# EAGLE design rgb_led (EAGLE 6.4)
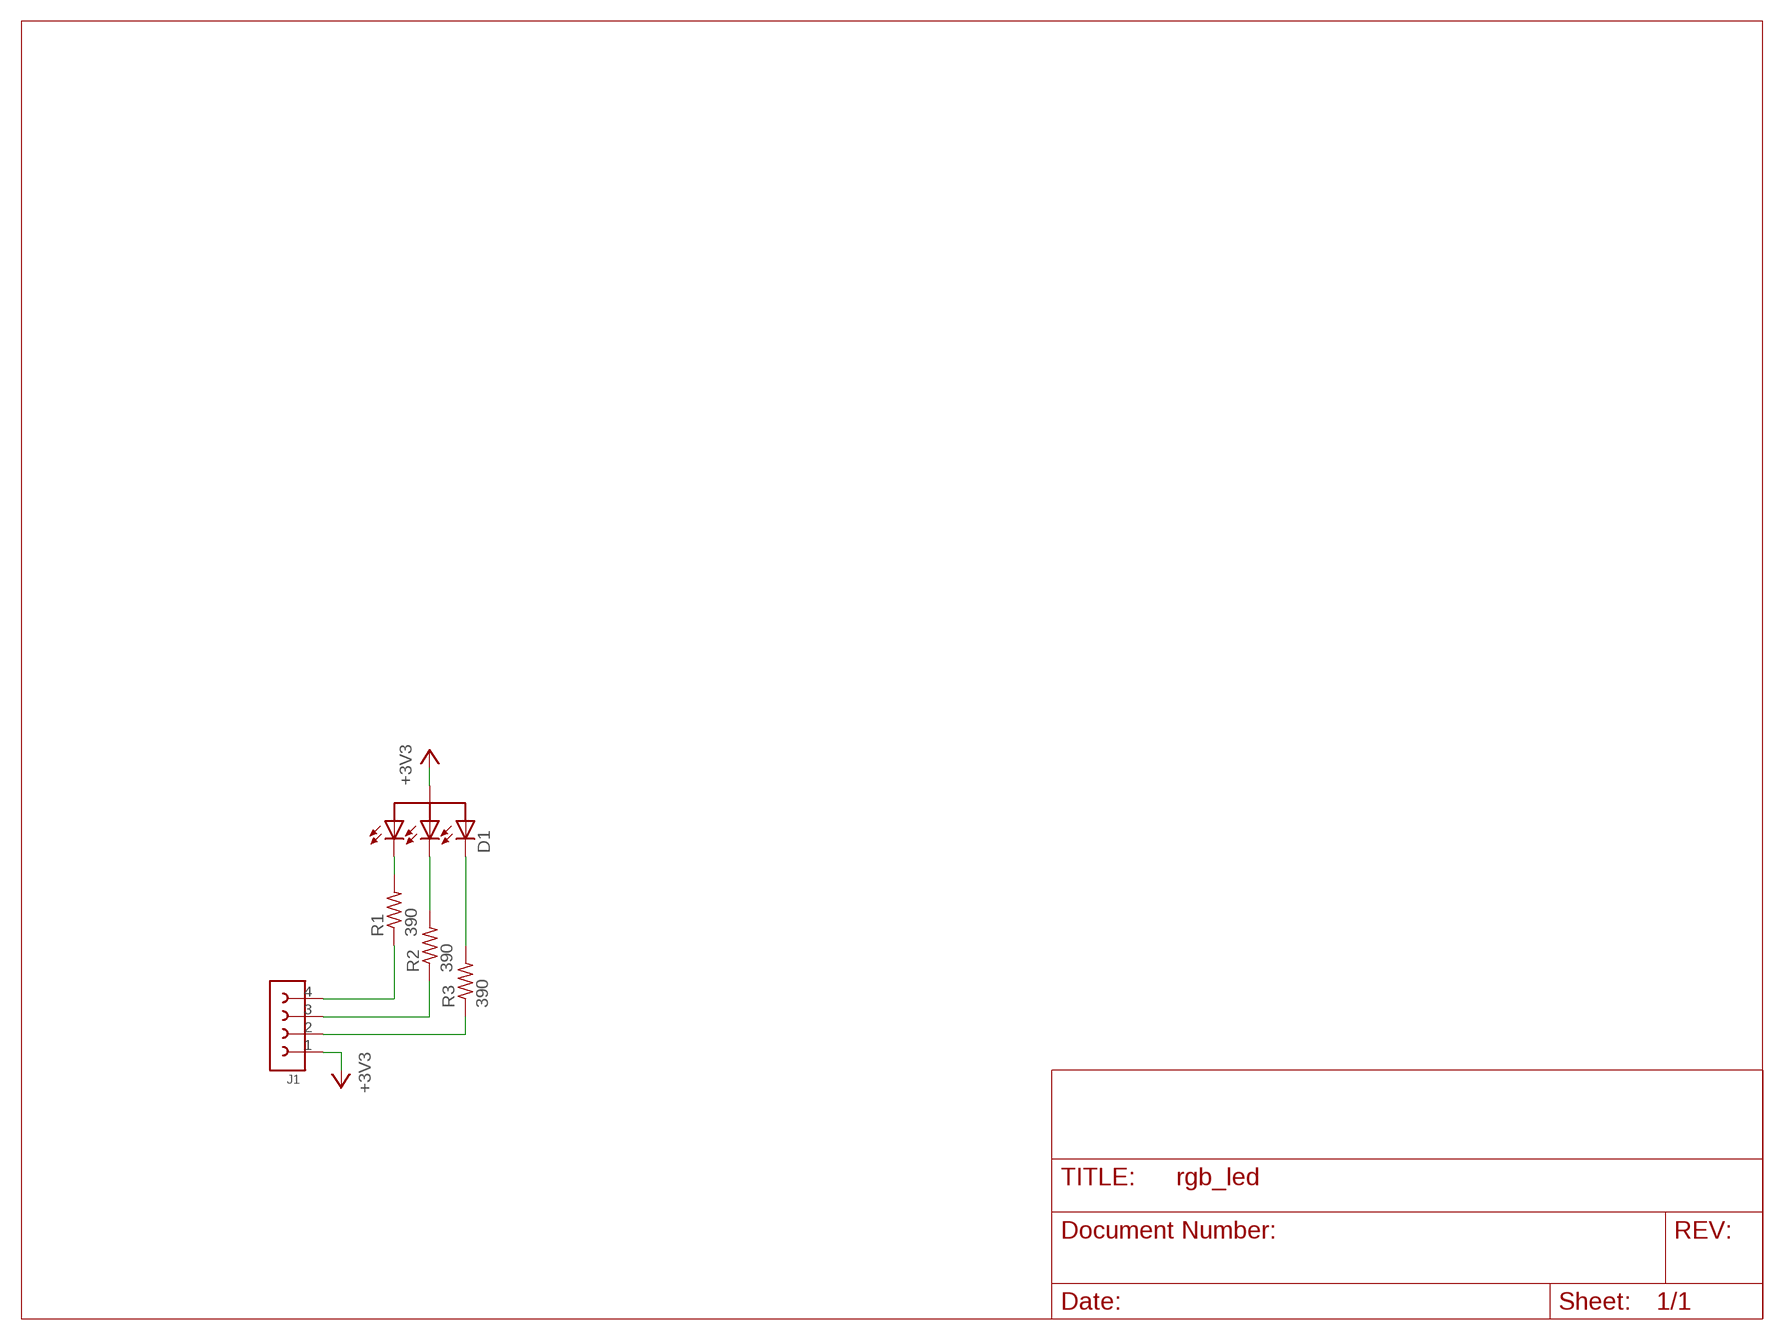
[diagram p0: schematic, sheet 1]

## Parts
D1  SM1210RGB  [D1210]
J1  61300411121  [PHSP254P1016X254X1154-4S]
R1  390  CRG0603F390R  [RESC0603]
R2  390  CRG0603F390R  [RESC0603]
R3  390  CRG0603F390R  [RESC0603]

## Nets
+3V3: D1.1(A) J1.1
N$1: D1.2(C3) R1.P$2
N$2: D1.4(C2) R2.P$2
N$3: D1.3(C1) R3.P$2
N$4: J1.4 R1.P$1
N$5: J1.2 R3.P$1
N$6: J1.3 R2.P$1

## Library data of the parts
D1 = bivar-smleds:SM1210RGB: Surface Mount RGB LED 1210 Description Bivar Surface Mount 1210 package RGB LED combines three chips in a single package. They are ideal for small scale applications where multiple signals need to be displayed. Wide variety of colors can be created by simply mixing the three chips in different combinations. Bivar offers water clear LED lens for high luminous intensity and wide viewing angles making them suitable for lighting and display applications. The SM1210 RGB LED is packaged in standard tape and reels for pick and place assemblies. ♦ Industry Standard Package ♦ RoHS Compliant ♦ Three Chips in One Package ♦ Water Clear Lens ♦ Wide Viewing Angle ♦ Ideal for Status Indication and Lighting How to Order Ref: Link <http://www.bivar.com/Products/LEDIndication/LEDs/SurfaceMountLEDs.aspx>; AVRG-PRICE: 2.46; DATASHEET: http://www.bivar.com/Images/Cart/SM1210RGB.pdf; DESCRIPTION: LED, SMD, 1210, 4 Leads, Tri-Color, Super Red/HE Green/Super Blue, Water Clear Lens, 130 Deg Viewing Angle; DIGIKEY: 492-1243-2-ND; EAGLEUP: D1210; MOUSER: 749-SM1210RGB; NEWARK: 92C8134; OCTOPART-LINK: http://octopart.com/sm1210rgb-bivar-2191590
J1 = wurth-pin-socket-headers:6130041?: (4) 2.54mm Pin Header Description MATERIAL INSULATOR: PBT FLAMABILITY RATING: UL94-V0 COLOR: BLACK CONTACT MATERIAL: COPPER ALLOY CONTACT TYPE: STAMPED CONTACT PLATING: GOLD QUALITY CLASS: 3 AS PER CECC 75 301-802 PITCH: 2.54MM ENVIRONMENTAL OPERATING TEMPERATURE: -40 UP TO 125°C COMPLIANCE: LEAD FREE AND ROHS ELECTRICAL CURRENT RATING: 3A WORKING VOLTAGE: 250V AC INSULATOR RESISTANCE: >1000 MOHM DIELECTRIC WITHSTANDING VOLTAGE: 500V AC/MN CONTACT RESISTANCE: 20 mOHM MAX DIMENSION B = 2.54 x NB POSITIONS How to order Type Header/Socket Number of Positions Variation 613 = 2.54mm Pitch from 1 to 40 1121 = Pin Header Straigh Post 1021 = Pin Header Right Angle 1821 = Socket Header Straigh Post 43121 = Socket Header Right Angle Ref: Datasheet <http://katalog.we-online.de/em/datasheet/6130xx11121.pdf> , Datasheet <http://katalog.we-online.de/em/datasheet/6130xx11021.pdf> , Datasheet <http://katalog.we-online.de/em/datasheet/6130xx11821.pdf> , Datasheet <http://katalog.we-online.de/em/datasheet/6130xx143121.pdf>
R1-R3 = te-fixed-resistors:CRG?*: Thick Film Chip Resistors 1% and 5% tolerance Description Precious metal terminations are screen printed onto a ceramic base and fired. The resistive element is screen printed and fired and the passivation layer added. Each resistor is trimmed to tolerance by laser. The pre-scribed tile is broken into strips, the end plating is fired on and the strips broken into individual components. Final termination is made by electroplating. Key Features Thick film resistors with a high power to size ratio,ideally suited to industrial and general purpose use. A range from 1 ohm to 10M and tolerances of 1% and 5%. Also including zero ohm links. Suitable for most applications, including high frequency operation, owing to the short lead structure and low capacitance. Seven Package Sizes Terminal finish: Matte Sn MSL Level 2 How to order Common Part Size Tolerance Resistance Value CRG - Thick Film Chip Resistor 0201 0402 0603 0805 1206 2512 F - ±1% J - ±5% 1 ohm (1 ohm) 1R0 1K ohm (1000 ohms) 1K 100K ohm (100000 ohms) 100K 1M ohm (1000000 ohms) 1M Ref: Datasheet <http://www.te.com/commerce/DocumentDelivery/DDEController?Action=showdoc&DocId=Data+Sheet%7F1773204%7FH%7Fpdf%7FEnglish%7FENG_DS_1773204_H.pdf%7F1623095-1>; AVRG-PRICE: 0.1; DATASHEET: http://www.te.com/commerce/DocumentDelivery/DDEController?Action=showdoc&DocId=Data+Sheet%7F1773204%7FH%7Fpdf%7FEnglish%7FENG_DS_1773204_H.pdf%7F1623095-1; DESCRIPTION: Resistores de película gruesa - SMD 0603 390Ohms 1/10W 50V; EAGLEUP: RESC0603; MOUSER: 279-CRG0603F390R; OCTOPART-LINK: http://octopart.com/crg0603f390r-tyco+electronics-16077369

## Board
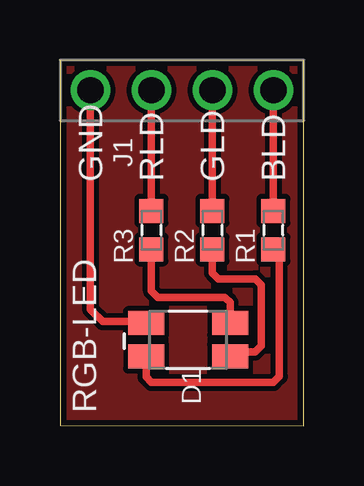
[diagram p1: board, top side]
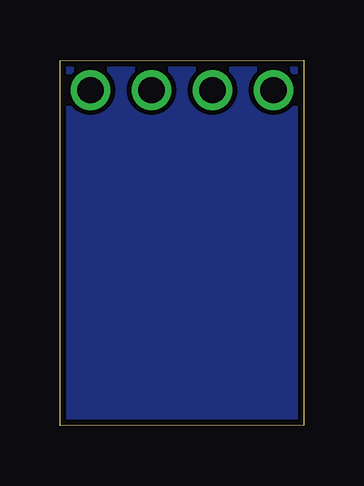
[diagram p2: board, bottom side, seen from below]

Size 10.16 x 15.26 mm. Coordinates in mm from the lower left corner, seen from the top.
Outline: 0,0.03 10.16,0 10.16,15.23 0,15.26 0,0.03
Copper layers (1*16): Top 0.035mm / dielectric 1.5mm / Bottom 0.035mm
Design rules "default *": minimum track width 10mil, minimum drill 24mil, track to track 8mil, track to pad 8mil, pad to pad 8mil, via to via 8mil, smd to smd 8mil, copper to edge 10mil, drill to drill 8mil, minimum pad ring 10mil, minimum via ring 8mil, stop-mask expansion 4mil, vias tented up to drill 0mil, thermal gap 10mil

### Footprints (pad centres in the part's own frame; a part is rotated, then mirrored left to right if it is on the bottom)
D1210 = smd 1.5 x 1: 1 1.75,-0.7; 2 1.75,0.7; 3 -1.75,-0.7; 4 -1.75,0.7
PHSP254P1016X254X1154-4S = drill 1.1: 1 0,0; 2 2.54,0; 3 5.08,0; 4 7.62,0
RESC0603 = smd 1 x 1: P$1 0.8,0; P$2 -0.8,0

### Placement (x,y rotation side)
D1  5.33,3.58 180 top
J1  1.27,14 0 top
R1  8.89,8.15 90 top
R2  6.35,8.15 90 top
R3  3.81,8.15 90 top

### Tracks (layer width: path | path; a pad name or v marks a point on that pad's centre or on a via)
+3V3
  Top 0.305: J1.1 1.27,4.85 1.78,4.34 3.52,4.34 D1.1
GND
  pour Top: 0,15.27 10.16,15.27 10.16,0.03 0,0.03
  pour Bottom: 0,15.27 10.16,15.27 10.16,0.03 0,0.03
N$1
  Top 0.305: D1.2 3.58,2.03 3.81,1.8 8.89,1.8 9.14,2.06 9.14,7.1 R1.P$2
N$2
  Top 0.305: R2.P$2 6.35,6.38 6.6,6.12 8.13,6.12 8.38,5.87 8.38,3.33 8.13,3.07 7.28,3.07 D1.4
N$3
  Top 0.305: D1.3 7.08,5.13 6.86,5.36 4.06,5.36 3.81,5.61 R3.P$2
N$4
  Top 0.305: J1.4 R1.P$1
N$5
  Top 0.305: J1.2 R3.P$1
N$6
  Top 0.305: J1.3 R2.P$1

### Text on the board
tPlace: GND | RLD | GLD | BLD | RGB-LED